# EAGLE design PGTN021_octasource2a_controls (EAGLE 9.6.0)
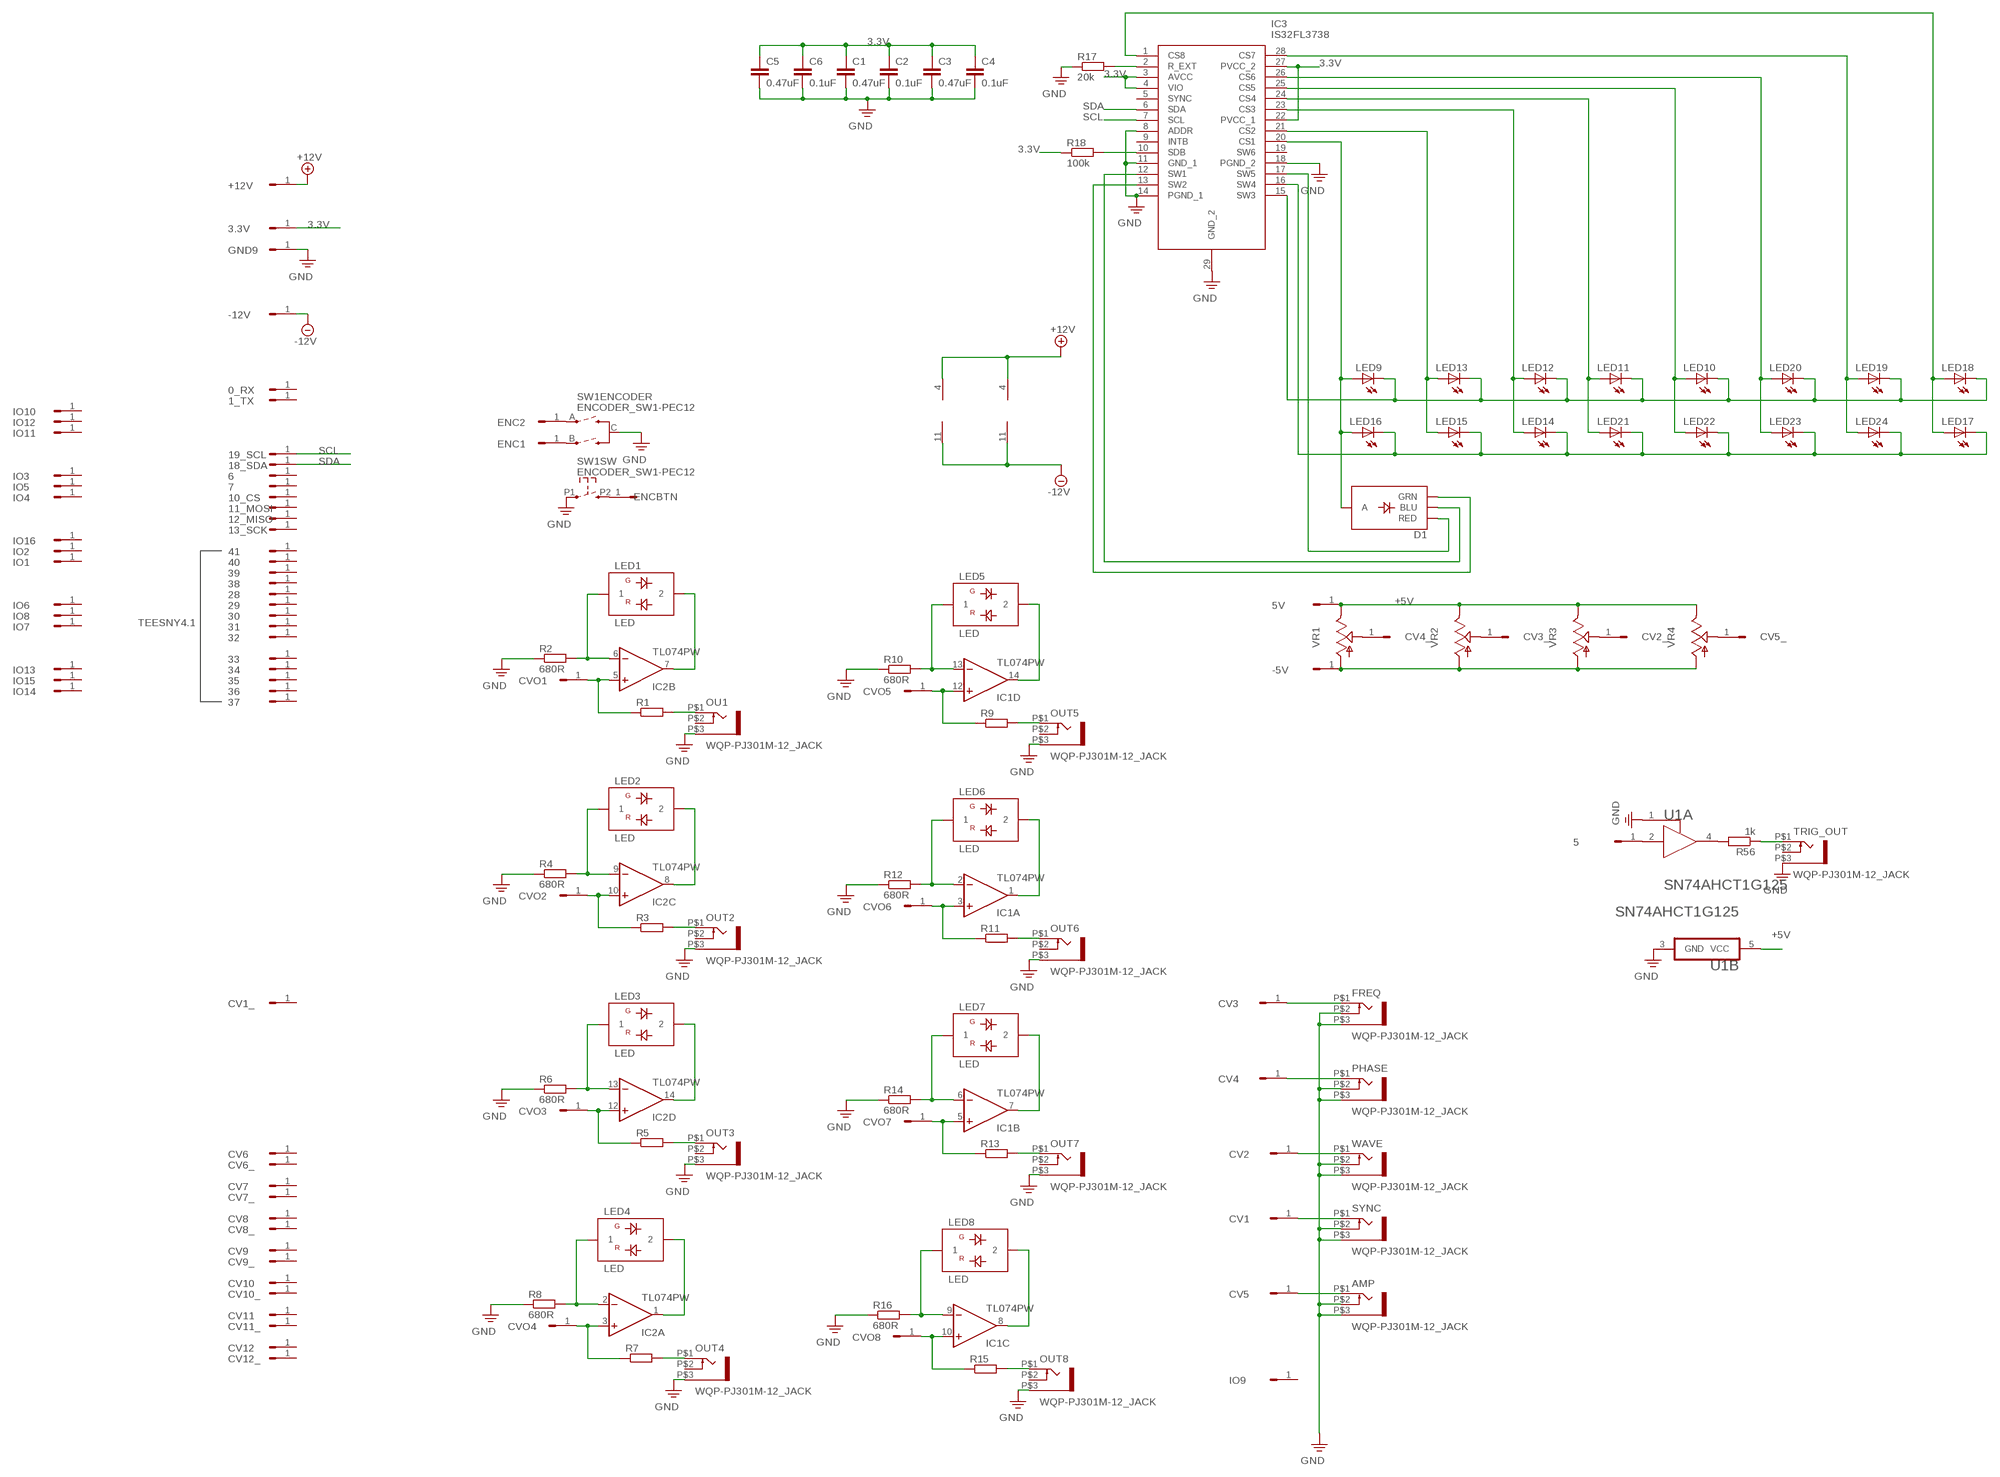
[diagram p0: schematic, sheet 1]

## Parts
0_RX  HEADER/MALE/01  [HEADER/MALE/01]
1_TX  HEADER/MALE/01  [HEADER/MALE/01]
3.3V  HEADER/MALE/01  [HEADER/MALE/01]
5  HEADER/MALE/01  [HEADER/MALE/01]
5V  HEADER/MALE/01  [HEADER/MALE/01]
6  HEADER/MALE/01  [HEADER/MALE/01]
7  HEADER/MALE/01  [HEADER/MALE/01]
10_CS  HEADER/MALE/01  [HEADER/MALE/01]
11_MOSI  HEADER/MALE/01  [HEADER/MALE/01]
12_MISO  HEADER/MALE/01  [HEADER/MALE/01]
13_SCK  HEADER/MALE/01  [HEADER/MALE/01]
18_SDA  HEADER/MALE/01  [HEADER/MALE/01]
19_SCL  HEADER/MALE/01  [HEADER/MALE/01]
28  HEADER/MALE/01  [HEADER/MALE/01]
29  HEADER/MALE/01  [HEADER/MALE/01]
30  HEADER/MALE/01  [HEADER/MALE/01]
31  HEADER/MALE/01  [HEADER/MALE/01]
32  HEADER/MALE/01  [HEADER/MALE/01]
33  HEADER/MALE/01  [HEADER/MALE/01]
34  HEADER/MALE/01  [HEADER/MALE/01]
35  HEADER/MALE/01  [HEADER/MALE/01]
36  HEADER/MALE/01  [HEADER/MALE/01]
37  HEADER/MALE/01  [HEADER/MALE/01]
38  HEADER/MALE/01  [HEADER/MALE/01]
39  HEADER/MALE/01  [HEADER/MALE/01]
40  HEADER/MALE/01  [HEADER/MALE/01]
41  HEADER/MALE/01  [HEADER/MALE/01]
+12V  HEADER/MALE/01  [HEADER/MALE/01]
-5V  HEADER/MALE/01  [HEADER/MALE/01]
-12V  HEADER/MALE/01  [HEADER/MALE/01]
AMP  WQP-PJ301M-12_JACK  [WQP-PJ301M-12_JACK]
C1  0.47uF  CAPACITORC0603  [C0603]
C2  0.1uF  CAPACITORC0603  [C0603]
C3  0.47uF  CAPACITORC0603  [C0603]
C4  0.1uF  CAPACITORC0603  [C0603]
C5  0.47uF  CAPACITORC0603  [C0603]
C6  0.1uF  CAPACITORC0603  [C0603]
CV1  HEADER/MALE/01  [HEADER/MALE/01]
CV1_  HEADER/MALE/01  [HEADER/MALE/01]
CV2  HEADER/MALE/01  [HEADER/MALE/01]
CV2_  HEADER/MALE/01  [HEADER/MALE/01]
CV3  HEADER/MALE/01  [HEADER/MALE/01]
CV3_  HEADER/MALE/01  [HEADER/MALE/01]
CV4  HEADER/MALE/01  [HEADER/MALE/01]
CV4_  HEADER/MALE/01  [HEADER/MALE/01]
CV5  HEADER/MALE/01  [HEADER/MALE/01]
CV5_  HEADER/MALE/01  [HEADER/MALE/01]
CV6  HEADER/MALE/01  [HEADER/MALE/01]
CV6_  HEADER/MALE/01  [HEADER/MALE/01]
CV7  HEADER/MALE/01  [HEADER/MALE/01]
CV7_  HEADER/MALE/01  [HEADER/MALE/01]
CV8  HEADER/MALE/01  [HEADER/MALE/01]
CV8_  HEADER/MALE/01  [HEADER/MALE/01]
CV9  HEADER/MALE/01  [HEADER/MALE/01]
CV9_  HEADER/MALE/01  [HEADER/MALE/01]
CV10  HEADER/MALE/01  [HEADER/MALE/01]
CV10_  HEADER/MALE/01  [HEADER/MALE/01]
CV11  HEADER/MALE/01  [HEADER/MALE/01]
CV11_  HEADER/MALE/01  [HEADER/MALE/01]
CV12  HEADER/MALE/01  [HEADER/MALE/01]
CV12_  HEADER/MALE/01  [HEADER/MALE/01]
CVO1  HEADER/MALE/01  [HEADER/MALE/01]
CVO2  HEADER/MALE/01  [HEADER/MALE/01]
CVO3  HEADER/MALE/01  [HEADER/MALE/01]
CVO4  HEADER/MALE/01  [HEADER/MALE/01]
CVO5  HEADER/MALE/01  [HEADER/MALE/01]
CVO6  HEADER/MALE/01  [HEADER/MALE/01]
CVO7  HEADER/MALE/01  [HEADER/MALE/01]
CVO8  HEADER/MALE/01  [HEADER/MALE/01]
D1  LED-RGB-CADIALIGHT1210  [CHIPLED_1210]
ENC1  HEADER/MALE/01  [HEADER/MALE/01]
ENC2  HEADER/MALE/01  [HEADER/MALE/01]
ENCBTN  HEADER/MALE/01  [HEADER/MALE/01]
FREQ  WQP-PJ301M-12_JACK  [WQP-PJ301M-12_JACK]
GND9  HEADER/MALE/01  [HEADER/MALE/01]
IC1  TL074PW  [TSSOP14]
IC2  TL074PW  [TSSOP14]
IC3  IS32FL3738  [TSSOP29]
IO1  HEADER/MALE/01  [HEADER/MALE/01]
IO2  HEADER/MALE/01  [HEADER/MALE/01]
IO3  HEADER/MALE/01  [HEADER/MALE/01]
IO4  HEADER/MALE/01  [HEADER/MALE/01]
IO5  HEADER/MALE/01  [HEADER/MALE/01]
IO6  HEADER/MALE/01  [HEADER/MALE/01]
IO7  HEADER/MALE/01  [HEADER/MALE/01]
IO8  HEADER/MALE/01  [HEADER/MALE/01]
IO9  HEADER/MALE/01  [HEADER/MALE/01]
IO10  HEADER/MALE/01  [HEADER/MALE/01]
IO11  HEADER/MALE/01  [HEADER/MALE/01]
IO12  HEADER/MALE/01  [HEADER/MALE/01]
IO13  HEADER/MALE/01  [HEADER/MALE/01]
IO14  HEADER/MALE/01  [HEADER/MALE/01]
IO15  HEADER/MALE/01  [HEADER/MALE/01]
IO16  HEADER/MALE/01  [HEADER/MALE/01]
LED1  LED  LED-BICOLOR-SHARED  [OG-LEDS_LED3MM]
LED2  LED  LED-BICOLOR-SHARED  [OG-LEDS_LED3MM]
LED3  LED  LED-BICOLOR-SHARED  [OG-LEDS_LED3MM]
LED4  LED  LED-BICOLOR-SHARED  [OG-LEDS_LED3MM]
LED5  LED  LED-BICOLOR-SHARED  [OG-LEDS_LED3MM]
LED6  LED  LED-BICOLOR-SHARED  [OG-LEDS_LED3MM]
LED7  LED  LED-BICOLOR-SHARED  [OG-LEDS_LED3MM]
LED8  LED  LED-BICOLOR-SHARED  [OG-LEDS_LED3MM]
LED9  LEDCHIPLED_0805  [CHIPLED_0805]
LED10  LEDCHIPLED_0805  [CHIPLED_0805]
LED11  LEDCHIPLED_0805  [CHIPLED_0805]
LED12  LEDCHIPLED_0805  [CHIPLED_0805]
LED13  LEDCHIPLED_0805  [CHIPLED_0805]
LED14  LEDCHIPLED_0805  [CHIPLED_0805]
LED15  LEDCHIPLED_0805  [CHIPLED_0805]
LED16  LEDCHIPLED_0805  [CHIPLED_0805]
LED17  LEDCHIPLED_0805  [CHIPLED_0805]
LED18  LEDCHIPLED_0805  [CHIPLED_0805]
LED19  LEDCHIPLED_0805  [CHIPLED_0805]
LED20  LEDCHIPLED_0805  [CHIPLED_0805]
LED21  LEDCHIPLED_0805  [CHIPLED_0805]
LED22  LEDCHIPLED_0805  [CHIPLED_0805]
LED23  LEDCHIPLED_0805  [CHIPLED_0805]
LED24  LEDCHIPLED_0805  [CHIPLED_0805]
OU1  WQP-PJ301M-12_JACK  [WQP-PJ301M-12_JACK]
OUT2  WQP-PJ301M-12_JACK  [WQP-PJ301M-12_JACK]
OUT3  WQP-PJ301M-12_JACK  [WQP-PJ301M-12_JACK]
OUT4  WQP-PJ301M-12_JACK  [WQP-PJ301M-12_JACK]
OUT5  WQP-PJ301M-12_JACK  [WQP-PJ301M-12_JACK]
OUT6  WQP-PJ301M-12_JACK  [WQP-PJ301M-12_JACK]
OUT7  WQP-PJ301M-12_JACK  [WQP-PJ301M-12_JACK]
OUT8  WQP-PJ301M-12_JACK  [WQP-PJ301M-12_JACK]
PHASE  WQP-PJ301M-12_JACK  [WQP-PJ301M-12_JACK]
R1  RESISTOR  [R0603]
R2  680R  RESISTOR  [R0603]
R3  RESISTOR  [R0603]
R4  680R  RESISTOR  [R0603]
R5  RESISTOR  [R0603]
R6  680R  RESISTOR  [R0603]
R7  RESISTOR  [R0603]
R8  680R  RESISTOR  [R0603]
R9  RESISTOR  [R0603]
R10  680R  RESISTOR  [R0603]
R11  RESISTOR  [R0603]
R12  680R  RESISTOR  [R0603]
R13  RESISTOR  [R0603]
R14  680R  RESISTOR  [R0603]
R15  RESISTOR  [R0603]
R16  680R  RESISTOR  [R0603]
R17  20k  RESISTOR  [R0603]
R18  100k  RESISTOR  [R0603]
R56  1k  RESISTOR  [R0603]
SW1  ENCODER_SW1-PEC12  [PEC12_INCREMENTAL_ENCODER]
SYNC  WQP-PJ301M-12_JACK  [WQP-PJ301M-12_JACK]
TRIG_OUT  WQP-PJ301M-12_JACK  [WQP-PJ301M-12_JACK]
U1  74AHCT1G125"  [74AHCT1G125]
VR1  9MM_SNAP-IN_POT_  [9MM_SNAP-IN_POT]
VR2  9MM_SNAP-IN_POT_  [9MM_SNAP-IN_POT]
VR3  9MM_SNAP-IN_POT_  [9MM_SNAP-IN_POT]
VR4  9MM_SNAP-IN_POT_  [9MM_SNAP-IN_POT]
WAVE  WQP-PJ301M-12_JACK  [WQP-PJ301M-12_JACK]

## Nets
3.3V: 3.3V.1 C1.1 C2.1 C3.1 C4.1 C5.1 C6.1 IC3.3(AVCC) IC3.4(VIO) IC3.22(PVCC_1) IC3.27(PVCC_2) R18.1
+5V: 5V.1 U1.5(B:VCC) VR1.3(E) VR2.3(E) VR3.3(E) VR4.3(E)
+12V: +12V.1 IC1.4(P:V+) IC2.4(P:V+)
-12V: -12V.1 IC1.11(P:V-) IC2.11(P:V-)
N$1: IC2.6(B:-IN) LED1.1 R2.2
N$2: IC2.7(B:OUT) LED1.2
N$3: CVO1.1 IC2.5(B:+IN) R1.1
N$4: OU1.P$1 R1.2
N$5: IC2.9(C:-IN) LED2.1 R4.2
N$6: IC2.8(C:OUT) LED2.2
N$7: CVO2.1 IC2.10(C:+IN) R3.1
N$8: OUT2.P$1 R3.2
N$9: IC2.13(D:-IN) LED3.1 R6.2
N$10: IC2.14(D:OUT) LED3.2
N$11: CVO3.1 IC2.12(D:+IN) R5.1
N$12: OUT3.P$1 R5.2
N$13: IC2.2(A:-IN) LED4.1 R8.2
N$14: IC2.1(A:OUT) LED4.2
N$15: CVO4.1 IC2.3(A:+IN) R7.1
N$16: OUT4.P$1 R7.2
N$17: IC1.13(D:-IN) LED5.1 R10.2
N$18: IC1.14(D:OUT) LED5.2
N$19: CVO5.1 IC1.12(D:+IN) R9.1
N$20: OUT5.P$1 R9.2
N$21: IC1.2(A:-IN) LED6.1 R12.2
N$22: IC1.1(A:OUT) LED6.2
N$23: CVO6.1 IC1.3(A:+IN) R11.1
N$24: OUT6.P$1 R11.2
N$25: IC1.6(B:-IN) LED7.1 R14.2
N$26: IC1.7(B:OUT) LED7.2
N$27: CVO7.1 IC1.5(B:+IN) R13.1
N$28: OUT7.P$1 R13.2
N$29: IC1.9(C:-IN) LED8.1 R16.2
N$30: IC1.8(C:OUT) LED8.2
N$31: CVO8.1 IC1.10(C:+IN) R15.1
N$32: OUT8.P$1 R15.2
N$33: IC3.10(SDB) R18.2
N$34: R56.2 U1.4(A:Y)
N$35: 5.1 U1.2(A:A)
N$36: ENCBTN.1 SW1.P2
N$37: ENC2.1 SW1.A(ENCODER:A)
N$38: ENC1.1 SW1.B(ENCODER:B)
N$39: CV1.1 SYNC.P$1
N$40: -5V.1 VR1.1(A) VR2.1(A) VR3.1(A) VR4.1(A)
N$41: CV2.1 WAVE.P$1
N$42: CV3.1 FREQ.P$1
N$43: CV4.1 PHASE.P$1
N$44: AMP.P$1 CV5.1
N$45: CV2_.1 VR3.2(S)
N$46: CV3_.1 VR2.2(S)
N$47: CV4_.1 VR1.2(S)
N$48: CV5_.1 VR4.2(S)
N$49: R56.1 TRIG_OUT.P$1
N$50: D1.4(A) IC3.20(CS1) LED9.A LED16.A
N$51: IC3.21(CS2) LED13.A LED15.A
N$52: IC3.23(CS3) LED12.A LED14.A
N$53: D1.2(RED) IC3.17(SW5)
N$54: D1.1(BLU) IC3.12(SW1)
N$55: D1.3(GRN) IC3.13(SW2)
N$62: IC3.16(SW4) LED14.C LED15.C LED16.C LED17.C LED21.C LED22.C LED23.C LED24.C
N$63: IC3.15(SW3) LED9.C LED10.C LED11.C LED12.C LED13.C LED18.C LED19.C LED20.C
N$65: IC3.24(CS4) LED11.A LED21.A
N$66: IC3.25(CS5) LED10.A LED22.A
N$67: IC3.26(CS6) LED20.A LED23.A
N$68: IC3.28(CS7) LED19.A LED24.A
N$69: IC3.1(CS8) LED17.A LED18.A
N$70: IC3.2(R_EXT) R17.2
PE: AMP.P$2 AMP.P$3 C1.2 C2.2 C3.2 C4.2 C5.2 C6.2 FREQ.P$2 FREQ.P$3 GND9.1 IC3.8(ADDR) IC3.11(GND_1) IC3.14(PGND_1) IC3.18(PGND_2) IC3.29(GND_2) OU1.P$3 OUT2.P$3 OUT3.P$3 OUT4.P$3 OUT5.P$3 OUT6.P$3 OUT7.P$3 OUT8.P$3 PHASE.P$2 PHASE.P$3 R2.1 R4.1 R6.1 R8.1 R10.1 R12.1 R14.1 R16.1 R17.1 SW1.C(ENCODER:C) SW1.P1 SYNC.P$2 SYNC.P$3 TRIG_OUT.P$3 U1.1(A:!OE!) U1.3(B:GND) WAVE.P$2 WAVE.P$3 ; supply symbol labelled GND
SCL: 19_SCL.1 IC3.7(SCL)
SDA: 18_SDA.1 IC3.6(SDA)
Unconnected: 0_RX.1 1_TX.1 6.1 7.1 10_CS.1 11_MOSI.1 12_MISO.1 13_SCK.1 28.1 29.1 30.1 31.1 32.1 33.1 34.1 35.1 36.1 37.1 38.1 39.1 40.1 41.1 CV1_.1 CV6.1 CV6_.1 CV7.1 CV7_.1 CV8.1 CV8_.1 CV9.1 CV9_.1 CV10.1 CV10_.1 CV11.1 CV11_.1 CV12.1 CV12_.1 IC3.5(SYNC) IC3.9(INTB) IC3.19(SW6) IO1.1 IO2.1 IO3.1 IO4.1 IO5.1 IO6.1 IO7.1 IO8.1 IO9.1 IO10.1 IO11.1 IO12.1 IO13.1 IO14.1 IO15.1 IO16.1 OU1.P$2 OUT2.P$2 OUT3.P$2 OUT4.P$2 OUT5.P$2 OUT6.P$2 OUT7.P$2 OUT8.P$2 TRIG_OUT.P$2

## Notes on the sheet
- TEESNY4.1

## Library data of the parts
0_RX 1_TX 3.3V 5 5V 6 7 10_CS 11_MOSI 12_MISO 13_SCK 18_SDA 19_SCL 28-41 +12V -5V -12V CV1 CV1_ CV2 CV2_ CV3 CV3_ CV4 CV4_ CV5 CV5_ CV6 CV6_ CV7 CV7_ CV8 CV8_ CV9 CV9_ CV10 CV10_ CV11 CV11_ CV12 CV12_ CVO1-CVO8 ENC1 ENC2 ENCBTN GND9 IO1-IO16 = connectors:HEADER/MALE/01; SPICEPREFIX: X
AMP FREQ OU1 OUT2-OUT8 PHASE SYNC TRIG_OUT WAVE = controls:WQP-PJ301M-12_JACK
C1-C6 = capacitors:CAPACITOR: CAPACITOR, European symbol
D1 = display_led:LED-RGB-CA: LED-RGB Diffused Common Anode Packages: LED RGB-THRU P-LCC-4-3 LED-TRICOLOR-SMD SparkFun Products: RGB Diffused Common Anode- Diffuse <[https://www.sparkfun.com/products/10821]> RGB Diffused Common Anode - Clear <[https://www.sparkfun.com/products/10820]> Qduino Mini <[https://www.sparkfun.com/products/13614]> Triple Output LED RGB - SMD <https://www.sparkfun.com/products/7844>
IC1 IC2 = ic_analogue:TL074: OP AMP
IC3 = ic_digital:IS32FL3738: IC LED DRIVER 6X8 28TSSOP Source: Datasheet <http://www.issi.com/WW/pdf/IS32FL3738.pdf>; DESCRIPTION: IC LED DRIVER 6X8 28TSSOP; HEIGHT: 1.2mm; MANUFACTURER_NAME: ISSI, Integrated Silicon Solution Inc; MANUFACTURER_PART_NUMBER: IS32FL3738-ZLA3-TR
LED1-LED8 = display_led:LED-BICOLOR-SHARED
LED9-LED24 = display_led:LED: LED OSRAM: - CHIPLED LG R971, LG N971, LY N971, LG Q971, LY Q971, LO R971, LY R971 LH N974, LH R974 LS Q976, LO Q976, LY Q976 LO Q996 - Hyper CHIPLED LW Q18S LB Q993, LB Q99A, LB R99A - SideLED LS A670, LO A670, LY A670, LG A670, LP A670 LB A673, LV A673, LT A673, LW A673 LH A674 LY A675 LS A676, LA A676, LO A676, LY A676, LW A676 LS A679, LY A679, LG A679 - Hyper Micro SIDELED® LS Y876, LA Y876, LO Y876, LY Y876 LT Y87S - SmartLED LW L88C, LW L88S LB L89C, LB L89S, LG L890 LS L89K, LO L89K, LY L89K LS L896, LA L896, LO L896, LY L896 - TOPLED LS T670, LO T670, LY T670, LG T670, LP T670 LSG T670, LSP T670, LSY T670, LOP T670, LYG T670 LG T671, LOG T671, LSG T671 LB T673, LV T673, LT T673, LW T673 LH T674 LS T676, LA T676, LO T676, LY T676, LB T676, LH T676, LSB T676, LW T676 LB T67C, LV T67C, LT T67C, LS T67K, LO T67K, LY T67K, LW E67C LS E67B, LA E67B, LO E67B, LY E67B, LB E67C, LV E67C, LT E67C LW T67C LS T679, LY T679, LG T679 LS T770, LO T770, LY T770, LG T770, LP T770 LB T773, LV T773, LT T773, LW T773 LH T774 LS E675, LA E675, LY E675, LS T675 LS T776, LA T776, LO T776, LY T776, LB T776 LHGB T686 LT T68C, LB T68C - Hyper Mini TOPLED® LB M676 - Mini TOPLED Santana® LG M470 LS M47K, LO M47K, LY M47K Source: http://www.osram.convergy.de LUXEON: - LUMILED® LXK2-PW12-R00, LXK2-PW12-S00, LXK2-PW14-U00, LXK2-PW14-V00 LXK2-PM12-R00, LXK2-PM12-S00, LXK2-PM14-U00 LXK2-PE12-Q00, LXK2-PE12-R00, LXK2-PE12-S00, LXK2-PE14-T00, LXK2-PE14-U00 LXK2-PB12-K00, LXK2-PB12-L00, LXK2-PB12-M00, LXK2-PB14-N00, LXK2-PB14-P00, LXK2-PB14-Q00 LXK2-PR12-L00, LXK2-PR12-M00, LXK2-PR14-Q00, LXK2-PR14-R00 LXK2-PD12-Q00, LXK2-PD12-R00, LXK2-PD12-S00 LXK2-PH12-R00, LXK2-PH12-S00 LXK2-PL12-P00, LXK2-PL12-Q00, LXK2-PL12-R00 Source: www.luxeon.com KINGBRIGHT: KA-3528ASYC Source: www.kingbright.com
R1-R18 R56 = resistors:RESISTOR: RESISTOR, European symbol
SW1 = controls:ENCODER_SW1: Incremental Encoder with push switch
U1 = ic_digital:74AHCT1G125: TI-SN74AXXXX1X125-5; 3_STATE_OUTPUT: Yes; BITS: 1; CIIVA_IDS: 19361320; DATASHEET_VERSION: SCLS378M; FOOTPRINT_VARIANT_NAME_0: Level C; FOOTPRINT_VARIANT_NAME_1: Level B; FOOTPRINT_VARIANT_NAME_2: Level A; F__NOM_VOLTAGEMAXMHZ: 75; ICC__NOM_VOLTAGEMAXMA: 0.01; IMPORTED: yes; IMPORTED_FROM: vault; IMPORT_TS: 1521860152; INPUT_TYPE: CMOS; LOGIC: true; MF: Texas Instruments; MPN: SN74AHCT1G125; OPERATING_TEMPERATURE_RANGEC: -40 to 125; OUTPUT_DRIVE_IOLIOHMAXMA: 8/-8; OUTPUT_TYPE: CMOS; PACKAGE: DBV0005A; PIN_0_0_1_OUTSIDE_EDGE: dot; PREFIX: U; RATING: Catalog; RELEASE_DATE: 1459324136; SCHMITT_TRIGGER: No; SUB__FAMILY: Non-Inverting Buffer/Driver; TECHNOLOGY_FAMILY: AHCT; TPD__NOM_VOLTAGEMAXNS: 6; VAULT_GUID: D4F6E077-2F5C-4B23-8C12-AA7674079390; VAULT_REVISION: 30C08C77-DC7B-43EA-A3AC-F2B0253DD8E6; VCC_MAX_V: 5.5; VCC_MIN_V: 2; VOLTAGE_NOM_V: 5
VR1-VR4 = controls:9MM_SNAP-IN_POT: 9mm vertical snap-in pot, Alpha / Panasonic style

## Board
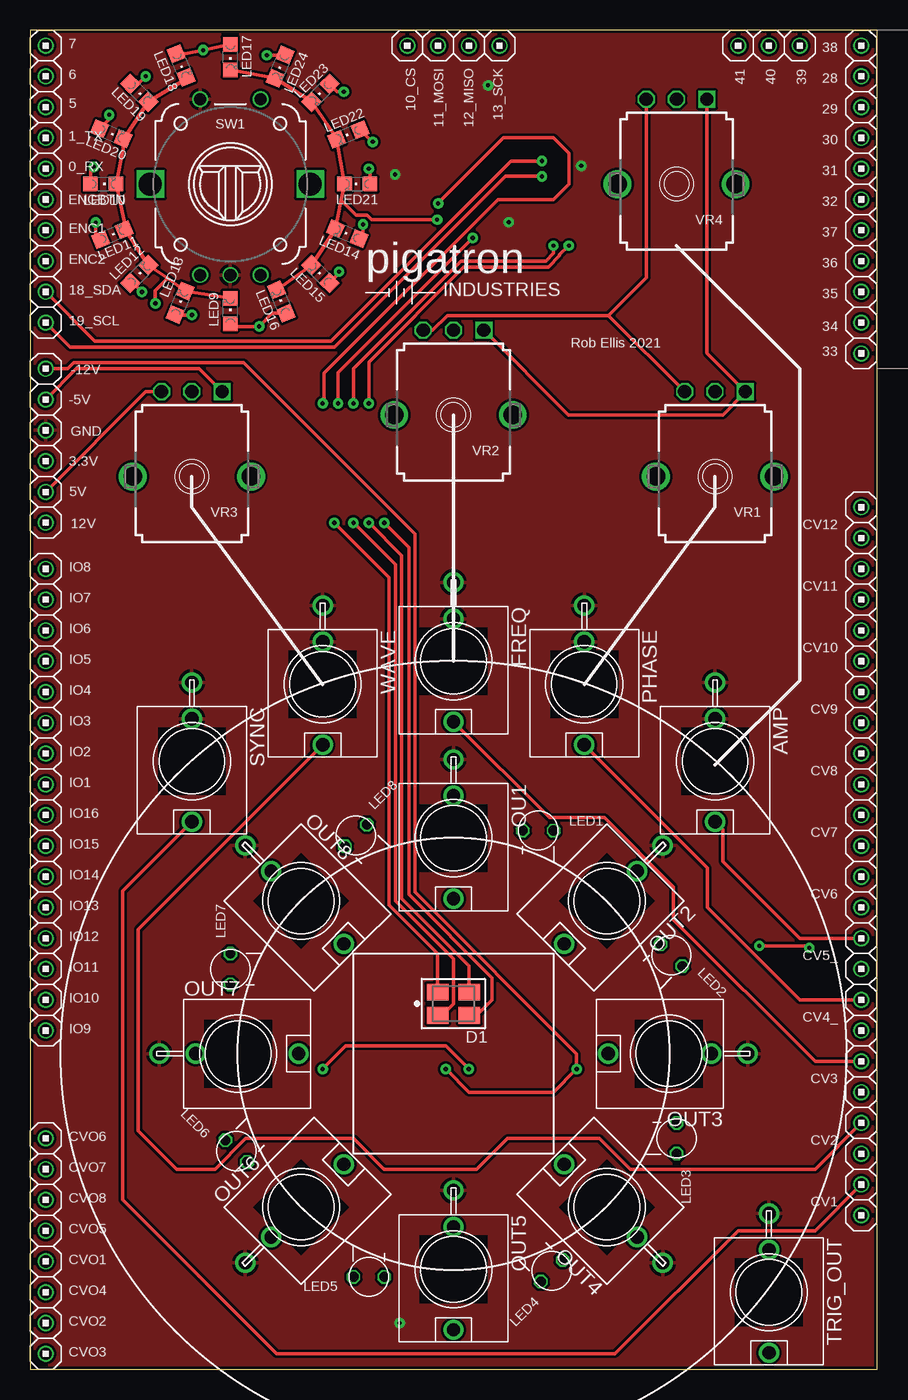
[diagram p1: board, top side]
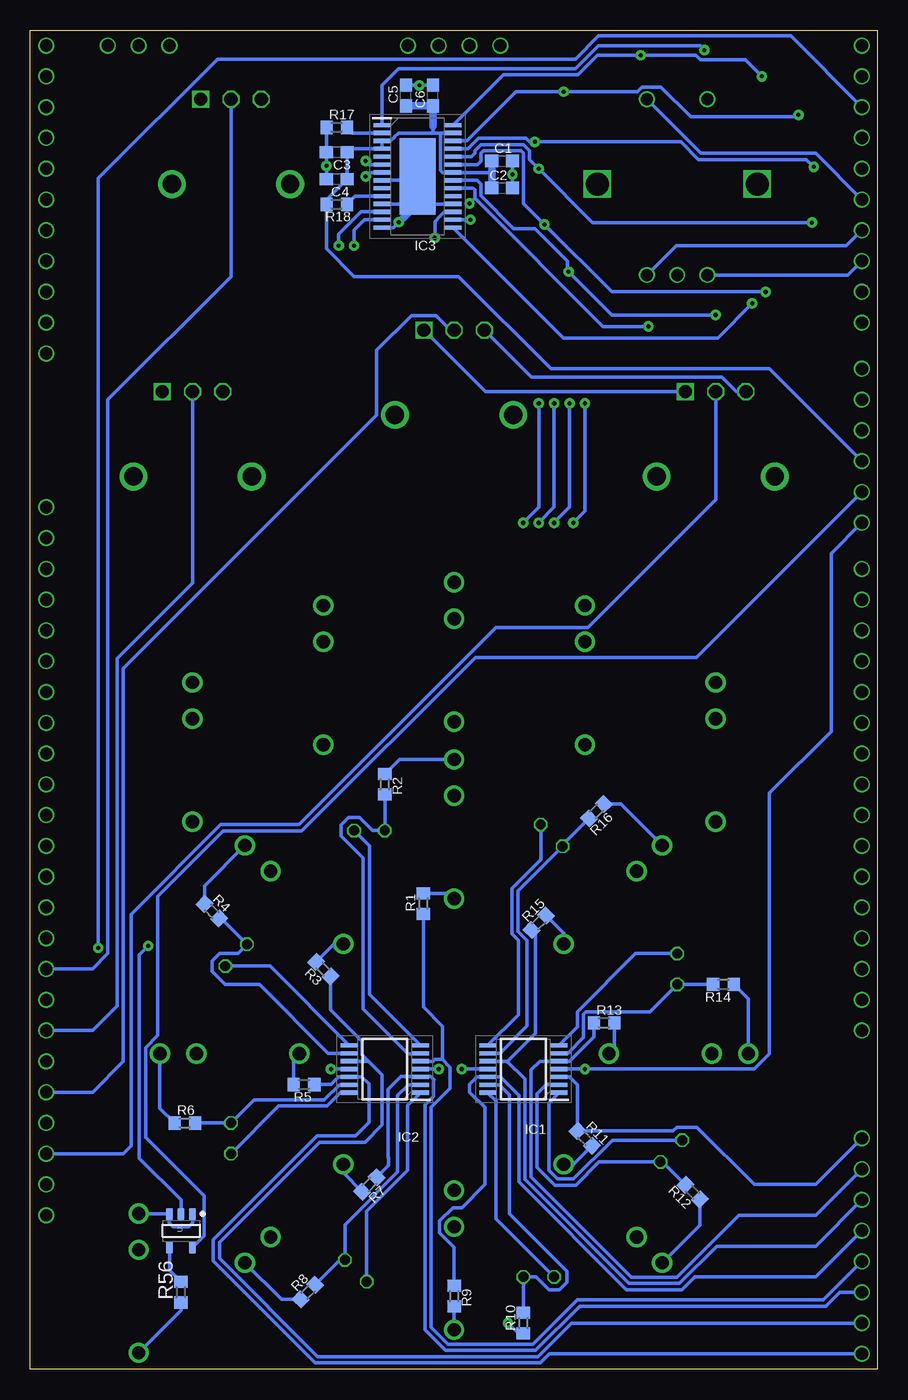
[diagram p2: board, bottom side, seen from below]

Size 69.9 x 110.48 mm. Coordinates in mm from the lower left corner, seen from the top.
Outline: 0,0 69.9,0 69.9,110.48 0,110.48 0,0
Copper layers (1*16): Top 0.0356mm / dielectric 1.5011mm / Bottom 0.0356mm
Design rules "pigatron *": minimum track width 8mil, minimum drill 13mil, track to track 8mil, track to pad 8mil, pad to pad 8mil, via to via 8mil, smd to smd 6mil, copper to edge 10mil, drill to drill 10mil, minimum pad ring 6mil, minimum via ring 10mil, stop-mask expansion 4mil, vias tented up to drill 0mil, thermal gap 10mil

### Footprints (pad centres in the part's own frame; a part is rotated, then mirrored left to right if it is on the bottom)
HEADER/MALE/01 = drill 1.016: 1 0,0
WQP-PJ301M-12_JACK = drill 1.1 pad 1.676: P$1 0,5; P$2 0,-3.5; P$3 0,-6.5
C0603 = smd 1.1 x 1: 1 -0.85,0; 2 0.85,0
CHIPLED_1210 = smd 1.8 x 1.4: 1 -1.3,0.95; 2 1.3,0.95; 3 -1.3,-0.95; 4 1.3,-0.95
TSSOP14 = smd 0.35 x 1.4: 1 -1.95,-2.938; 2 -1.3,-2.938; 3 -0.65,-2.938; 4 0,-2.938; 5 0.65,-2.938; 6 1.3,-2.938; 7 1.95,-2.938; 8 1.95,2.938; 9 1.3,2.938; 10 0.65,2.938; 11 0,2.938; 12 -0.65,2.938; 13 -1.3,2.938; 14 -1.95,2.938
TSSOP29 = smd 1.4 x 0.35: 1 -2.938,4.225; 2 -2.938,3.575; 3 -2.938,2.925; 4 -2.938,2.275; 5 -2.938,1.625; 6 -2.938,0.975; 7 -2.938,0.325; 8 -2.938,-0.325; 9 -2.938,-0.975; 10 -2.938,-1.625; 11 -2.938,-2.275; 12 -2.938,-2.925; 13 -2.938,-3.575; 14 -2.938,-4.225; 15 2.938,-4.225; 16 2.938,-3.575; 17 2.938,-2.925; 18 2.938,-2.275; 19 2.938,-1.625; 20 2.938,-0.975; 21 2.938,-0.325; 22 2.938,0.325; 23 2.938,0.975; 24 2.938,1.625; 25 2.938,2.275; 26 2.938,2.925; 27 2.938,3.575; 28 2.938,4.225 | smd 3 x 6.3: 29 0,0
OG-LEDS_LED3MM = drill 0.813 octagon: 1 -1.27,0; 2 1.27,0
CHIPLED_0805 = smd 1.2 x 1.2: A 0,-1.05; C 0,1.05
R0603 = smd 1 x 1.1: 1 -0.85,0; 2 0.85,0
PEC12_INCREMENTAL_ENCODER = drill 1: A -2.5,-7.5; B 2.5,-7.5; C 0,-7.5; P1 -2.5,7; P2 2.5,7 | drill 1.9 square: GND@1 -6.6,0; GND@2 6.6,0
74AHCT1G125 = smd 1 x 0.6: 1 -1.375,0.95; 2 -1.375,0; 3 -1.375,-0.95; 4 1.375,-0.95; 5 1.375,0.95
9MM_SNAP-IN_POT = drill 1.1 square: 1 -2.5,-7 | drill 1.1 octagon: 2 0,-7; 3 2.5,-7 | drill 1.524 pad 2.286: CHASSIS1 -4.881,0; CHASSIS2 4.881,0

### Placement (x,y rotation side)
0_RX  1.27,99.06 0 top
1_TX  1.27,101.6 0 top
3.3V  1.27,74.93 90 top
5  1.27,104.14 0 top
5V  1.27,72.39 180 top
6  1.27,106.68 0 top
7  1.27,109.22 0 top
10_CS  31.11,109.22 270 top
11_MOSI  33.66,109.22 270 top
12_MISO  36.2,109.22 270 top
13_SCK  38.73,109.22 270 top
18_SDA  1.27,88.9 0 top
19_SCL  1.27,86.36 0 top
28  68.58,106.68 180 top
29  68.58,104.14 180 top
30  68.58,101.6 180 top
31  68.58,99.06 180 top
32  68.58,96.52 180 top
33  68.58,83.82 180 top
34  68.58,86.36 180 top
35  68.58,88.9 180 top
36  68.58,91.44 180 top
37  68.58,93.98 180 top
38  68.58,109.22 180 top
39  63.5,109.22 270 top
40  60.96,109.22 270 top
41  58.42,109.22 270 top
+12V  1.27,69.85 0 top
-5V  1.27,80.01 0 top
-12V  1.27,82.55 0 top
AMP  56.52,50.16 180 top
C1  30.96,99.69 0 bottom
C2  30.96,97.47 0 bottom
C3  44.61,100.41 180 bottom
C4  44.61,98.19 180 bottom
C5  38.89,105.09 90 bottom
C6  36.67,105.09 90 bottom
CV1  68.58,15.24 0 top
CV1_  68.58,12.7 0 top
CV2  68.58,20.32 0 top
CV2_  68.58,17.78 0 top
CV3  68.58,25.4 0 top
CV3_  68.58,22.86 0 top
CV4  68.58,30.48 0 top
CV4_  68.58,27.94 0 top
CV5  68.58,35.56 180 top
CV5_  68.58,33.02 180 top
CV6  68.58,40.64 180 top
CV6_  68.58,38.1 180 top
CV7  68.58,43.18 180 top
CV7_  68.58,45.72 180 top
CV8  68.58,50.8 180 top
CV8_  68.58,48.26 180 top
CV9  68.58,53.34 180 top
CV9_  68.58,55.88 180 top
CV10  68.58,60.96 180 top
CV10_  68.58,58.42 180 top
CV11  68.58,66.04 180 top
CV11_  68.58,63.5 180 top
CV12  68.58,68.58 180 top
CV12_  68.58,71.12 180 top
CVO1  1.27,8.89 0 top
CVO2  1.27,3.81 0 top
CVO3  1.27,1.27 0 top
CVO4  1.27,6.35 0 top
CVO5  1.27,11.43 0 top
CVO6  1.27,19.05 0 top
CVO7  1.27,16.51 0 top
CVO8  1.27,13.97 0 top
D1  34.92,30.16 180 top
ENC1  1.27,93.98 0 top
ENC2  1.27,91.44 0 top
ENCBTN  1.27,96.52 0 top
FREQ  34.92,58.42 180 top
GND9  1.27,77.47 0 top
IC1  29.21,24.77 90 bottom
IC2  40.64,24.77 90 bottom
IC3  37.94,98.42 0 bottom
IO1  1.27,48.26 180 top
IO2  1.27,50.8 180 top
IO3  1.27,53.34 180 top
IO4  1.27,55.88 180 top
IO5  1.27,58.42 180 top
IO6  1.27,60.96 180 top
IO7  1.27,63.5 180 top
IO8  1.27,66.04 180 top
IO9  1.27,27.94 180 top
IO10  1.27,30.48 180 top
IO11  1.27,33.02 180 top
IO12  1.27,35.56 180 top
IO13  1.27,38.1 180 top
IO14  1.27,40.64 180 top
IO15  1.27,43.18 180 top
IO16  1.27,45.72 180 top
LED1  41.91,44.45 0 top
LED2  52.92,34.16 315 top
LED3  53.34,19.05 270 top
LED4  43.04,8.12 225 top
LED5  27.94,7.62 180 top
LED6  17,17.99 135 top
LED7  16.51,33.02 90 top
LED8  26.87,44.04 45 top
LED9  16.51,87.31 0 top
LED10  6.03,97.79 270 top
LED11  6.77,93.62 292.5 top
LED12  8.99,90.37 315 top
LED13  12.36,88.01 337.5 top
LED14  26.15,93.69 67.5 top
LED15  23.94,90.37 45 top
LED16  20.71,88.09 22.5 top
LED17  16.51,108.27 180 top
LED18  12.45,107.56 202.5 top
LED19  8.99,105.32 225 top
LED20  6.68,101.95 247.5 top
LED21  26.99,97.79 90 top
LED22  26.24,101.88 112.5 top
LED23  23.94,105.32 135 top
LED24  20.62,107.48 157.5 top
OU1  34.92,43.81 180 top
OUT2  47.6,38.63 135 top
OUT3  52.7,26.04 90 top
OUT4  47.6,13.37 45 top
OUT5  34.92,8.26 180 top
OUT6  22.34,13.37 315 top
OUT7  17.14,26.04 270 top
OUT8  22.34,38.63 225 top
PHASE  45.72,56.52 180 top
R1  37.47,38.42 90 bottom
R2  40.64,48.26 270 bottom
R3  45.72,33.02 135 bottom
R4  54.93,37.78 315 bottom
R5  47.31,23.5 180 bottom
R6  57.15,20.32 0 bottom
R7  41.91,15.24 225 bottom
R8  46.99,6.35 45 bottom
R9  34.92,6.03 270 bottom
R10  29.21,3.81 90 bottom
R11  24.13,19.05 315 bottom
R12  15.24,14.61 135 bottom
R13  22.54,28.57 0 bottom
R14  12.7,31.75 180 bottom
R15  27.94,36.83 45 bottom
R16  23.18,46.04 225 bottom
R17  44.61,102.47 0 bottom
R18  44.61,96.12 0 bottom
R56  57.47,6.35 90 bottom
SW1  16.51,97.79 0 top
SYNC  13.34,50.16 180 top
TRIG_OUT  60.96,6.35 180 top
U1  57.47,11.43 270 bottom
U$1  [PIGATRON-LOGO]  36.58,90.42 0 top
VR1  56.52,73.66 180 top
VR2  34.92,78.74 180 top
VR3  13.34,73.66 180 top
VR4  53.34,97.79 180 top
WAVE  24.13,56.52 180 top

### Tracks (layer width: path | path; a pad name or v marks a point on that pad's centre or on a via)
3.3V
  Bottom 0.305: IC3.27 36.04,102 | 36.04,102 36.67,102 | 36.67,102 39.52,102 39.82,101.69 39.82,101.68 40.15,101.35 IC3.3 IC3.4 43.47,100.7 C3.1 C4.1 45.46,96.49 R18.1 45.46,92.45 43.18,90.17 34.56,90.17 26.95,82.55 8.89,82.55 3.3V.1 | 36.04,102 36.04,101.69 36.06,101.67 36.06,98.92 35.88,98.74 35.87,98.75 IC3.22 31.81,98.75 31.81,98.74 | 36.67,102.55 36.67,102
  Bottom 0.61: C5.1 C6.1 36.67,102.55 | C1.1 31.81,98.74 C2.1
+5V
  Top 0.305: 5V.1 9.54,80.66 VR3.3 | VR2.3 33.21,85.74 34.42,86.95 47.73,86.95 | VR1.3 47.73,86.95 | VR4.3 50.84,90.07 47.73,86.95
  Bottom 0.305: VR3.3 11.62,80.66 12.83,81.87 28.55,81.87 VR2.3 | 5V.1 14.92,58.74 33.18,58.74 47.5,44.42 53.98,44.42 59.37,39.03 59.37,27.56 60.4,26.53 60.4,19.12 55.56,14.29 55.56,11.01 U1.5
+12V  (via drill 0.35)
  Top 0.305: v24.13,24.77 26.04,26.67 34.29,26.67 v36.2,24.77
  Bottom 0.305: +12V.1 3.81,67.31 3.81,52.62 8.89,47.54 8.89,26.04 10.16,24.77 v24.13,24.77 IC1.4 | IC2.4 v36.2,24.77
-12V  (via drill 0.35)
  Top 0.305: v34.29,24.77 36.2,22.86 43.18,22.86 v45.09,24.77 45.09,26.04 31.75,39.37 31.75,68.9 17.59,83.06 3.6,83.06 3.09,82.55 -12V.1
  Bottom 0.305: v45.09,24.77 IC2.11 | IC1.11 v34.29,24.77
N$1
  Bottom 0.305: R2.2 LED1.1 41.67,44.45 42.74,45.52 43.62,45.52 44.25,44.89 44.25,44.01 42.42,42.18 42.42,29.72 38.73,26.04 37.73,26.04 IC2.6
N$2
  Bottom 0.305: LED1.2 41.91,43.18 41.91,30.92 IC2.7
N$3
  Bottom 0.305: R1.1 37.47,29.9 35.87,28.31 35.87,25.55 | 35.87,25.55 36.52,25.55 36.66,25.41 IC2.5 | 35.87,25.55 35.24,24.92 35.24,23.18 36.83,21.59 36.83,3.47 35.42,2.06 28.42,2.06 24.77,5.71 4.45,5.71 CVO1.1
N$4
  Bottom 0.305: R1.2 35.38,39.27 OU1.P$1
N$5
  Bottom 0.305: R4.2 54.14,37.18 LED2.1 52.75,34.33 54.26,34.33 54.88,33.7 54.88,32.82 53.81,31.75 50.99,31.75 45.3,26.07 IC2.9
N$6
  Bottom 0.305: IC2.8 50.12,33.26 LED2.2
N$7
  Bottom 0.305: 41.99,25.42 42.63,25.42 IC2.10 | 41.99,25.42 40.86,24.29 40.86,20.16 42.29,18.73 46.04,18.73 54.29,10.48 54.29,9.17 46.17,1.04 28,1.04 25.23,3.81 CVO2.1 | 41.99,25.42 42.52,25.95 42.52,27.04 45.12,29.63 R3.1
N$8
  Bottom 0.305: R3.2 44.85,35.09 OUT2.P$1
N$9
  Bottom 0.305: R6.2 LED3.1 51.44,22.23 45.64,22.23 44.4,23.46 IC2.13
N$10
  Bottom 0.305: IC2.14 44.33,22.82 45.43,21.72 49.4,21.72 LED3.2
N$11
  Bottom 0.305: R5.1 45.09,23.5 44.47,24.11 IC2.12 43.56,24.13 42.55,24.13 41.94,23.53 41.94,20.35 43.05,19.24 46.25,19.24 54.8,10.69 54.8,8.96 46.38,0.54 27.79,0.54 27.05,1.27 CVO3.1
N$12
  Bottom 0.305: R5.2 48.16,25.58 OUT3.P$1
N$13
  Bottom 0.305: R8.2 44.33,9.01 LED4.1 43.94,11.93 39.58,16.29 39.58,22.59 38.7,23.46 IC2.2
N$14
  Bottom 0.305: LED4.2 42.14,13.01 38.75,16.4 38.75,21.77 IC2.1
N$15
  Bottom 0.305: R7.1 40.32,16.83 40.32,17.46 40.36,17.5 40.36,23.08 39.29,24.15 37.74,24.15 | 37.74,24.15 IC2.3 | 37.74,24.15 36.85,24.15 36.58,23.88 36.64,23.82 36.64,22.5 37.34,21.8 37.34,3.26 35.63,1.55 28.21,1.55 24.55,5.21 4.24,5.21 3.09,6.35 CVO4.1
N$16
  Bottom 0.305: R7.2 44.06,16.19 OUT4.P$1
N$17
  Bottom 0.305: R10.2 LED5.1 28.18,7.62 27.11,6.55 26.23,6.55 25.6,7.18 25.6,8.06 30.35,12.81 30.35,22.65 31.17,23.46 IC1.13
N$18
  Bottom 0.305: LED5.2 31.48,12.43 31.48,22.15 IC1.14
N$19
  Bottom 0.305: 32.13,24.13 31.11,24.13 29.59,22.61 29.59,15.45 20.7,6.57 16.12,6.57 15.07,7.62 5.08,7.62 CVO5.1 | 32.13,24.13 IC1.12 | 32.13,24.13 33.02,24.13 33.66,23.5 33.66,22.86 32.38,21.59 32.38,15.24 34.29,13.34 35.03,13.34 36.12,12.25 36.12,11.26 34.92,10.07 R9.1
N$20
  Bottom 0.305: R9.2 OUT5.P$1
N$21
  Bottom 0.305: R12.2 17.73,17.1 LED6.1 22.95,17.1 24.86,15.19 26.59,15.19 28.07,16.67 28.07,22.73 27.3,23.5 26.3,23.5 IC1.2
N$22
  Bottom 0.305: LED6.2 21.88,18.89 25.07,15.7 26.38,15.7 27.09,16.41 27.09,22 IC1.1
N$23
  Bottom 0.305: IC1.3 26.26,24.13 25.4,24.13 24.73,23.46 R11.1 16.85,19.65 16.54,19.96 14.88,19.96 10.16,15.24 5.08,15.24 CVO6.1
N$24
  Bottom 0.305: R11.2 25.07,16.91 OUT6.P$1
N$25
  Bottom 0.305: R14.2 LED7.1 18.78,29.48 24.04,29.48 24.25,29.27 24.25,27.36 25.54,26.07 IC1.6
N$26
  Bottom 0.305: IC1.7 24.76,28.23 24.76,29.48 19.95,34.29 LED7.2
N$27
  Bottom 0.305: R13.1 23.39,27.41 25.4,25.4 26.26,25.4 IC1.5 27.22,25.42 27.86,25.42 28.57,24.7 28.57,15.87 20.28,7.58 16.55,7.58 11.43,12.7 5.08,12.7 CVO7.1
N$28
  Bottom 0.305: R13.2 21.69,26.49 OUT7.P$1
N$29
  Bottom 0.305: R16.2 25.98,43.24 LED8.1 29.64,39.48 29.64,36.12 28.89,35.37 28.89,28.32 31.15,26.07 IC1.9
N$30
  Bottom 0.305: LED8.2 27.77,42.06 30.15,39.69 30.15,35.91 29.63,35.39 29.63,29.23 IC1.8
N$31
  Bottom 0.203: 30.56,25.38 30.64,25.4 30.56,25.42
  Bottom 0.305: 30.56,25.38 28.22,27.72 28.22,35.91 R15.1 | IC1.10 31.2,25.42 30.56,25.42 29.08,23.94 29.08,15.66 20.5,7.08 16.34,7.08 13.25,10.16 5.08,10.16 CVO8.1
N$32
  Bottom 0.305: R15.2 25.88,35.97 OUT8.P$1
N$33
  Bottom 0.305: IC3.10 43.08,96.8 R18.2
N$34
  Bottom 0.305: R56.2 58.42,8.15 U1.4
N$35  (via drill 0.33)
  Top 0.203: v64.29,34.77 64.14,34.92
  Top 0.305: 64.14,34.92 v60.17,34.92
  Bottom 0.305: v64.29,34.77 64.29,98.27 54.45,108.11 24.92,108.11 23.02,110.01 7.14,110.01 5.1 | U1.2 57.47,13.97 60.91,17.41 60.91,34.18 v60.17,34.92
N$36
  Bottom 0.305: SW1.P2 14.55,100.33 5.08,100.33 ENCBTN.1
N$37
  Bottom 0.305: SW1.A 2.42,90.29 ENC2.1
N$38
  Bottom 0.305: SW1.B 16.59,92.71 2.54,92.71 ENC1.1
N$39
  Top 0.305: SYNC.P$1 7.62,39.45 7.62,13.97 20.32,1.27 48.26,1.27 58.42,11.43 64.77,11.43 CV1.1
N$40
  Top 0.305: -5V.1 3.81,82.55 13.95,82.55 VR3.1 | VR2.1 44.42,78.74 57.15,78.74 59.02,80.61 VR1.1 55.84,83.83 VR4.1
  Bottom 0.305: VR3.1 32.34,80.66 VR2.1
N$41
  Top 0.305: WAVE.P$1 8.89,36.27 8.89,19.68 12.06,16.51 15.24,16.51 17.78,19.05 26.67,19.05 29.21,16.51 36.83,16.51 39.37,19.05 46.99,19.05 49.53,16.51 64.77,16.51 CV2.1
N$42
  Top 0.305: FREQ.P$1 42.83,45.52 47.37,45.52 53.09,39.8 53.09,37.09 64.77,25.4 CV3.1
N$43
  Top 0.305: PHASE.P$1 55.88,41.35 55.88,38.1 63.5,30.48 CV4.1
N$44
  Top 0.305: AMP.P$1 57.15,44.53 57.15,41.91 63.5,35.56 CV5.1
N$45
  Bottom 0.305: CV2_.1 62.23,17.78 61.59,18.41 61.59,37.52 54.17,44.94 47.71,44.94 31.45,61.21 23.88,61.21 13.34,71.75 VR3.2
N$46
  Bottom 0.305: VR2.2 35.21,85.74 36.42,86.95 38.43,86.95 41.3,84.07 41.3,78.74 62.23,57.81 62.23,25.4 64.77,22.86 CV3_.1
N$47
  Bottom 0.305: VR1.2 56.52,64.87 62.74,58.65 62.74,29.97 64.77,27.94 CV4_.1
N$48
  Bottom 0.305: VR4.2 53.34,90.17 63.5,80.01 63.5,34.29 64.77,33.02 CV5_.1
N$49
  Bottom 0.305: R56.1 57.47,4.84 TRIG_OUT.P$1
N$50  (via drill 0.35)
  Top 0.305: LED16.A 19.97,87.12 v18.89,86.04 16.73,86.04 LED9.A | D1.4 33.62,34.32 29.62,38.33 29.62,65.32 v25.08,69.85 | v24.13,79.69 24.26,79.82 24.26,82.2 38.58,96.52 43.18,96.52 44.45,97.79 44.45,100.33 43.18,101.6 39.05,101.6 v33.66,96.2
  Bottom 0.305: IC3.20 33.36,97.45 33.22,97.31 33.22,96.61 | 33.22,96.61 22.65,86.04 v18.89,86.04 | v25.08,69.85 24.13,70.8 v24.13,79.69 | v33.66,96.2 33.63,96.2 33.22,96.61
N$51  (via drill 0.35)
  Top 0.305: v25.48,90.57 25.48,90.42 LED15.A | v13.34,87 12,87 LED13.A
  Bottom 0.305: v13.34,87 21.91,87 v25.48,90.57 25.56,90.49 25.56,91.44 28.25,94.13 30.02,94.13 32.71,96.83 32.71,97.79 33.03,98.11 33.18,98.11 33.19,98.1 IC3.21
N$52  (via drill 0.35)
  Top 0.305: v27.46,94.46 27.46,93.63 LED14.A | v9.21,88.9 8.48,89.63 LED12.A
  Bottom 0.305: v9.21,88.9 21.91,88.9 v27.46,94.46 29.2,96.19 29.2,100.34 29.41,100.55 32.5,100.55 32.71,100.34 32.71,99.69 33.01,99.4 IC3.23
N$53  (via drill 0.35)
  Top 0.305: D1.2 33.98,29.21 34.92,30.16 34.92,33.84 30.12,38.64 30.12,66.4 v26.67,69.85 | v25.4,79.69 25.4,82.23 v36.51,93.34
  Bottom 0.305: v26.67,69.85 25.4,71.12 v25.4,79.69 | IC3.17 35.73,95.5 36.09,95.14 36.09,95.13 36.51,94.7 v36.51,93.34
N$54  (via drill 0.35)
  Top 0.305: D1.1 36.83,29.21 38.1,30.48 38.1,32.3 31.24,39.16 31.24,67.82 v29.21,69.85 | v27.94,79.69 27.94,83.1 35.77,90.93 42.76,90.93 43.69,91.86 43.69,91.95 v44.45,92.71
  Bottom 0.305: v27.94,79.69 27.94,71.12 v29.21,69.85 | IC3.12 42.61,95.5 44.45,93.66 v44.45,92.71
N$55  (via drill 0.35)
  Top 0.305: D1.3 36.23,33.26 30.63,38.85 30.63,67.16 v27.94,69.85 | v26.67,79.69 26.67,82.55 35.56,91.44 42.55,91.44 43.18,92.08 v43.18,92.71
  Bottom 0.305: v26.67,79.69 26.67,71.12 v27.94,69.85 | IC3.13 42.31,94.85 43.18,93.98 v43.18,92.71
N$62  (via drill 0.35)
  Top 0.305: LED16.C 20.51,89.16 LED15.C 25.09,93.89 LED14.C 25.67,96.47 | 25.67,96.47 LED21.C LED22.C 25.18,101.68 LED23.C 20.43,106.42 LED24.C | LED24.C | LED24.C LED17.C | v33.57,94.85 28.18,94.85 27.79,95.24 26.89,95.24 25.67,96.47
  Bottom 0.305: v33.57,94.85 IC3.16
N$63  (via drill 0.35)
  Top 0.305: LED18.C 12.6,106.34 LED19.C 7.95,101.85 LED20.C 7.65,100.73 LED10.C 7.74,94.75 LED11.C 8.03,93.72 LED12.C 11.34,90.04 | 11.34,90.04 10.32,89.01 v10.32,87.95 | LED9.C LED13.C 11.34,90.04
  Bottom 0.305: IC3.15 25.89,85.09 13.18,85.09 v10.32,87.95
N$65  (via drill 0.35)
  Top 0.305: v27.94,99.06 28.04,98.96 LED21.A | v5.4,94.61 5.4,93.62 LED11.A
  Bottom 0.305: v5.4,94.61 23.5,94.61 v27.94,99.06 28.69,99.81 28.69,100.55 29.2,101.06 32.71,101.06 33.22,100.55 33.22,100.33 33.5,100.05 IC3.24
N$66  (via drill 0.35)
  Top 0.305: v28.26,101.28 28.21,101.28 LED22.A | v5.24,99.22 4.98,98.96 LED10.A
  Bottom 0.305: v5.24,99.22 5.84,99.82 14.76,99.82 16.22,101.28 v28.26,101.28 28.7,101.28 28.99,101.57 32.92,101.57 33.79,100.7 IC3.25
N$67  (via drill 0.35)
  Top 0.305: v25.88,105.41 25.33,105.41 LED23.A | v6.51,103.5 6.51,103.15 LED20.A
  Bottom 0.305: v6.51,103.5 6.67,103.35 15.4,103.35 17.85,105.8 19.43,105.8 19.82,105.41 v25.88,105.41 29.8,105.41 33.86,101.35 IC3.26
N$68  (via drill 0.35)
  Top 0.305: v19.53,108.43 21.01,108.43 LED24.A | v9.53,106.68 8.91,106.06 LED19.A
  Bottom 0.305: v9.53,106.68 10.9,108.06 14.59,108.06 14.96,108.43 v19.53,108.43 23.09,108.43 24.71,106.81 30.85,106.81 IC3.28
N$69  (via drill 0.35)
  Top 0.305: LED17.A v14.27,108.84 12.8,108.53 LED18.A
  Bottom 0.305: v14.27,108.84 14.27,108.88 14.61,109.22 23.02,109.22 24.92,107.31 39.53,107.31 40.88,105.97 IC3.1
N$70
  Bottom 0.305: IC3.2 43.29,102 R17.2
PE  (via drill 0.35)
  Bottom 0.305: R12.1 14.64,11.89 OUT6.P$3 | R8.1 49.16,5.75 OUT4.P$3 | R6.1 59.2,21.52 OUT3.P$3 | R4.1 55.53,39.89 OUT2.P$3 | R2.1 39.44,50.31 OU1.P$3 | R16.1 21.16,46.64 OUT8.P$3 | R14.1 10.64,30.55 OUT7.P$3 | R10.1 29.63,2.96 v30.48,3.81 | IC3.8 38.27,98.1 | 38.27,98.1 IC3.29 | IC3.18 36.78,96.15 38.27,97.64 38.27,98.1 | IC3.14 39.93,94.2 v39.48,94.65 | 38.49,95.64 37.94,96.18 IC3.29 | IC3.29 37.94,96.78 38.58,96.15 IC3.11 | C6.2 v37.78,105.94 C5.2 | R17.1 C3.2 v45.46,99.3 C4.2 | C2.2 v30.11,98.58 C1.2 | U1.1 56.52,12.07 56.52,12.06 56.83,11.75 58.1,11.75 58.42,12.06 U1.3 60.91,12.8 TRIG_OUT.P$3
  Bottom 0.61: v39.48,94.65 38.49,95.64
  pour Top: 69.85,110.49 0,110.49 0,0 69.85,0
SCL  (via drill 0.35)
  Top 0.305: 19_SCL.1 3.3,84.33 25.11,84.33 39.21,98.42 v42.23,98.42
  Bottom 0.305: IC3.7 41.9,98.75 v42.23,98.42
SDA  (via drill 0.35)
  Top 0.305: v42.23,99.69 39.69,99.69 24.83,84.84 5.33,84.84 18_SDA.1
  Bottom 0.305: IC3.6 41.93,99.4 v42.23,99.69

### Text on the board
tNames: Rob Ellis 2021 | -12V | GND | 12V